# Altium schematic sheet Proximity_Sensors.SchDoc
size A
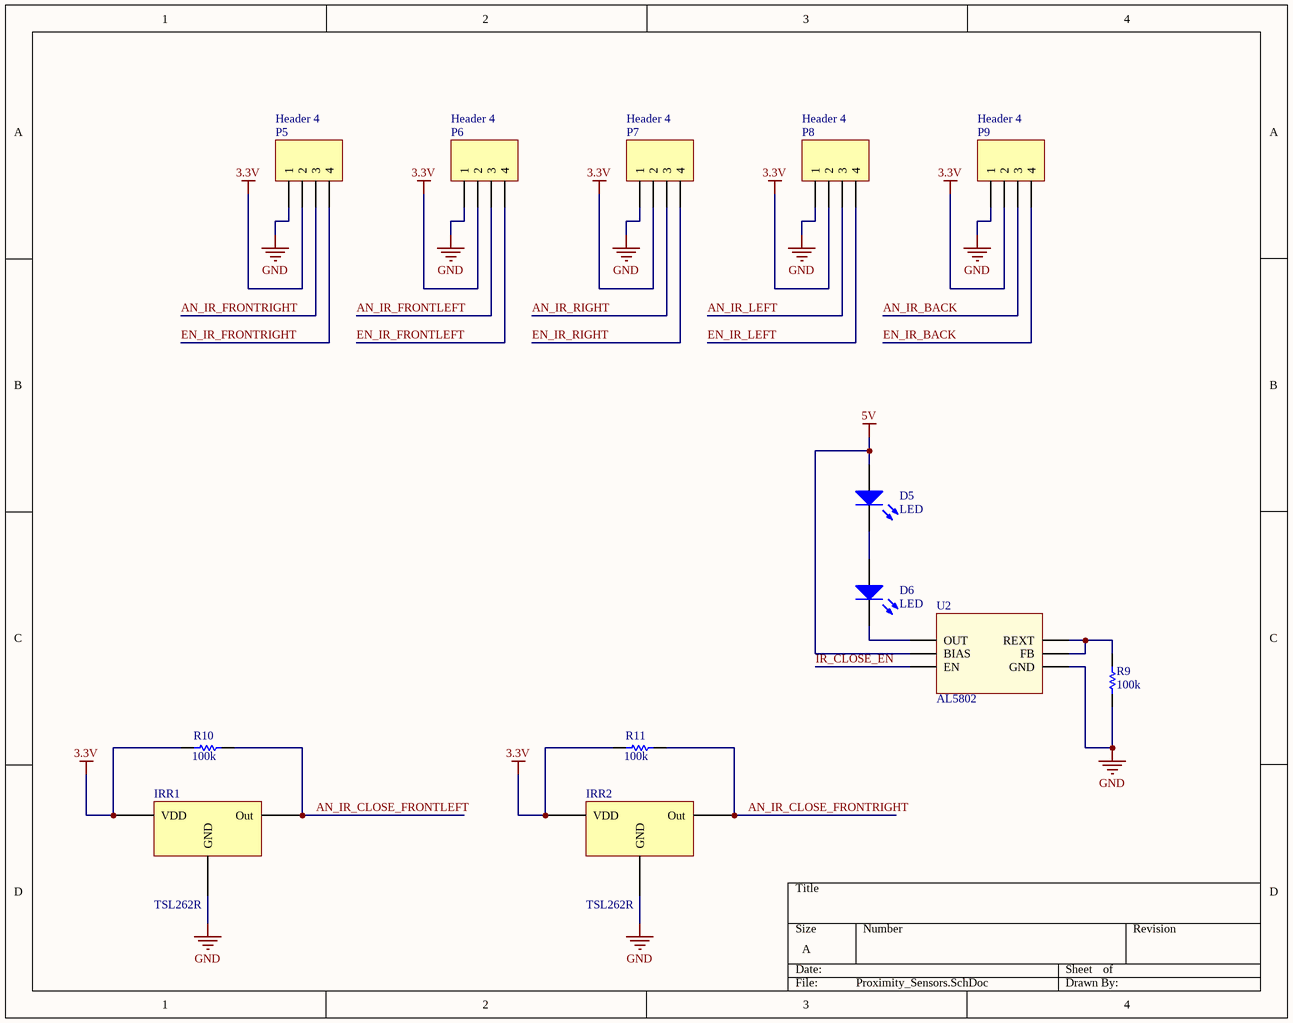
[diagram p0: Proximity_Sensors.SchDoc]

## Parts
D5  LED  [LED-Bent]
D6  LED  [LED-Bent]
IRR1  TSL262R  [TSL262R]
IRR2  TSL262R  [TSL262R]
P5  Header 4  [HDR1X4]
P6  Header 4  [HDR1X4]
P7  Header 4  [HDR1X4]
P8  Header 4  [HDR1X4]
P9  Header 4  [HDR1X4]
R9  value 100k  [0805]  (hidden comment: Resistor)
R10  value 100k  [0805]  (hidden comment: Resistor)
R11  value 100k  [0805]  (hidden comment: Resistor)
U2  AL5802  [SOT26]

## Nets
3.3V: IRR1.1(VDD) IRR2.1(VDD) P5.2 P6.2 P7.2 P8.2 P9.2 R10.1 R11.1
5V: D5.1(A) U2.2(BIAS)
GND: IRR1.0(GND) IRR2.0(GND) P5.1 P6.1 P7.1 P8.1 P9.1 R9.1 U2.4(GND)
AN_IR_BACK: P9.3
AN_IR_CLOSE_FRONTLEFT: IRR1.2(Out) R10.2
AN_IR_CLOSE_FRONTRIGHT: IRR2.2(Out) R11.2
AN_IR_FRONTLEFT: P6.3
AN_IR_FRONTRIGHT: P5.3
AN_IR_LEFT: P8.3
AN_IR_RIGHT: P7.3
EN_IR_BACK: P9.4
EN_IR_FRONTLEFT: P6.4
EN_IR_FRONTRIGHT: P5.4
EN_IR_LEFT: P8.4
EN_IR_RIGHT: P7.4
IR_CLOSE_EN: U2.3(EN)
NetD5_2: D5.2(K) D6.1(A)
NetD6_2: D6.2(K) U2.1(OUT)
NetR9_2: R9.2 U2.5(FB) U2.6(REXT)

## Library data of the parts
D5 D6 = LED: Vendor Part Number: 751-1203-ND; Manufacturer: Vishay; Manufacturer Part Number: TSAL6100; Vendor: Digikey; Published: 16-Mar-2013; LatestRevisionDate: 16-Mar-2013; LatestRevisionNote: Created; PackageReference: LED; Publisher: Anthony Merlino; PackageDescription: 5mm LED; 2 Leads
P5-P9 = Header 4: Header, 4-Pin; LatestRevisionDate: 17-Jul-2002; LatestRevisionNote: Re-released for DXP Platform.; Publisher: Altium Limited
R9-R11 = Resistor: Published: 8-Jun-2000; LatestRevisionDate: 17-Jul-2002; LatestRevisionNote: Re-released for DXP Platform.; PackageReference: AXIAL-0.3; Publisher: Altium Limited